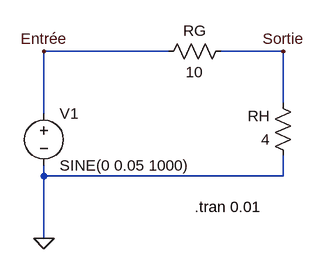
[diagram p0: schematic HP+Jack.asc]
HP+Jack.asc, the LTspice schematic file:
Version 4
SHEET 1 880 680
WIRE 336 256 144 256
WIRE 512 256 416 256
WIRE 512 336 512 256
WIRE 144 352 144 256
WIRE 144 448 144 432
WIRE 512 448 512 416
WIRE 512 448 144 448
WIRE 144 544 144 448
FLAG 144 544 0
FLAG 144 256 Entrée
FLAG 512 256 Sortie
SYMBOL Res 528 432 R180
WINDOW 0 36 76 Left 2
WINDOW 3 36 40 Left 2
SYMATTR InstName RH
SYMATTR Value 4
SYMBOL Voltage 144 336 R0
WINDOW 123 0 0 Left 0
WINDOW 39 0 0 Left 0
SYMATTR InstName V1
SYMATTR Value SINE(0 0.05 1000)
SYMBOL Res 432 240 R90
WINDOW 0 0 56 VBottom 2
WINDOW 3 32 56 VTop 2
SYMATTR InstName RG
SYMATTR Value 10
TEXT 376 496 Left 2 !.tran 0.01

The netlist it stands for:
* HP+Jack.asc
RH 0 Sortie 4
V1 Entrée 0 SINE(0 0.05 1000)
RG Sortie Entrée 10
.tran 0.01
.backanno
.end